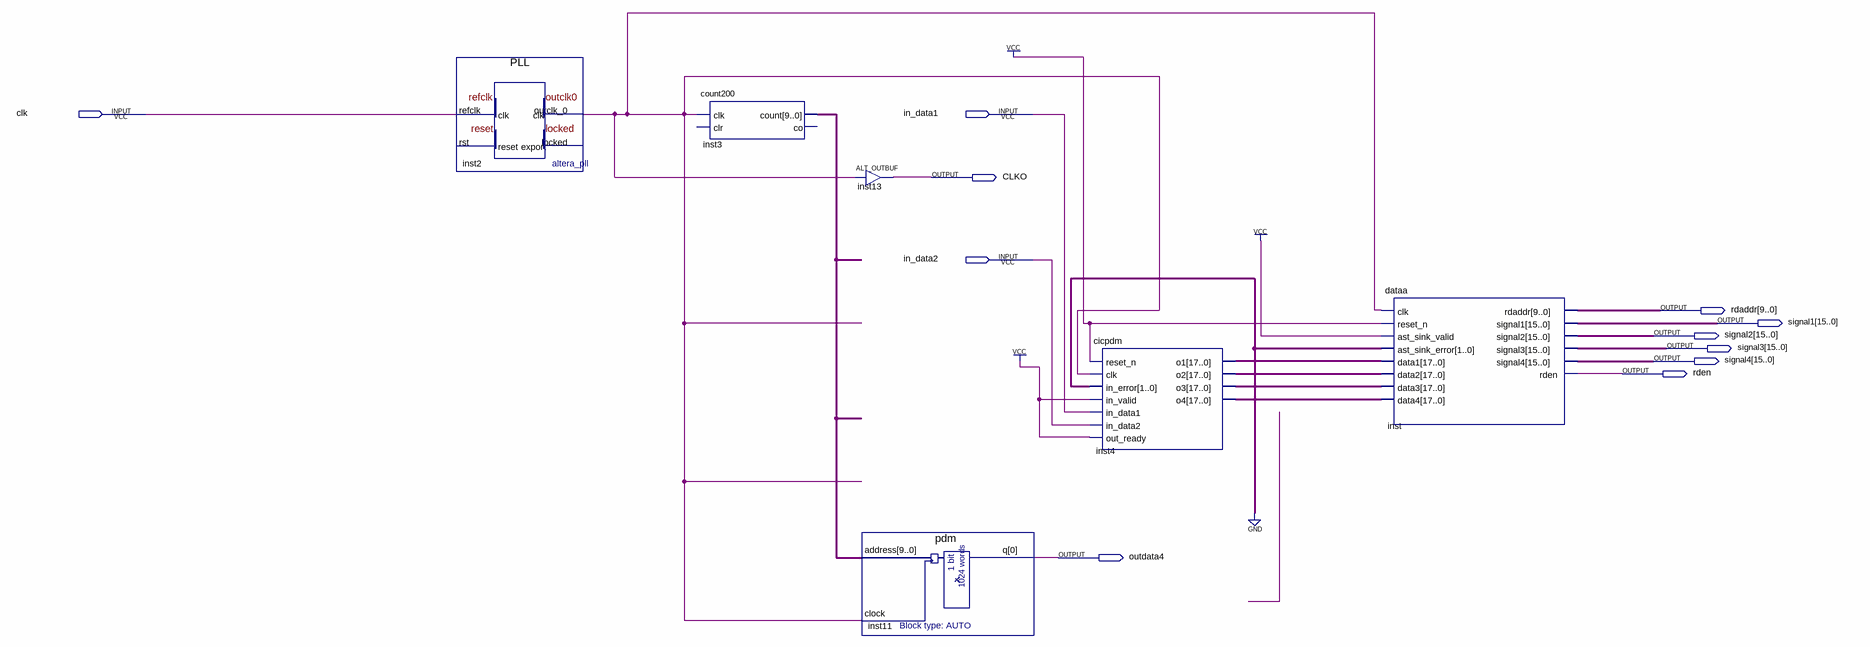
[diagram p0: schematic sheet]
// Quartus schematic xinhao.bdf as structural Verilog: 6 symbols, 11 pins
module xinhao (
  input  clk,
  input  in_data1,
  input  in_data2,
  output CLKO,
  output [9:0] rdaddr,
  output [15:0] signal1,
  output [15:0] signal2,
  output [15:0] signal3,
  output [15:0] signal4,
  output rden,
  output outdata4
);

  wire inst2_outclk_0;
  wire [9:0] inst3_count;
  wire [17:0] inst4_o1, inst4_o2, inst4_o3, inst4_o4;

  PLL inst2 (.refclk(clk), .outclk_0(inst2_outclk_0));  // open: rst, locked
  count200 inst3 (.clk(inst2_outclk_0), .count(inst3_count));  // open: clr, co
  ALT_OUTBUF inst13 (.i(inst2_outclk_0), .o(CLKO));
  pdm inst11 (.address(inst3_count), .clock(inst2_outclk_0), .q(outdata4));
  cicpdm inst4 (
    .reset_n(1'b1), .clk(inst2_outclk_0), .in_error(2'b00), .in_valid(1'b1), .in_data1(in_data1),
    .in_data2(in_data2), .out_ready(1'b1), .o1(inst4_o1), .o2(inst4_o2), .o3(inst4_o3), .o4(inst4_o4));
  dataa inst (
    .clk(inst2_outclk_0), .reset_n(1'b1), .ast_sink_valid(1'b1), .ast_sink_error(2'b00), .data1(inst4_o1),
    .data2(inst4_o2), .data3(inst4_o3), .data4(inst4_o4), .rdaddr(rdaddr), .signal1(signal1),
    .signal2(signal2), .signal3(signal3), .signal4(signal4), .rden(rden));
endmodule
